# EAGLE schematic MPPT_power (EAGLE 7.4.0)
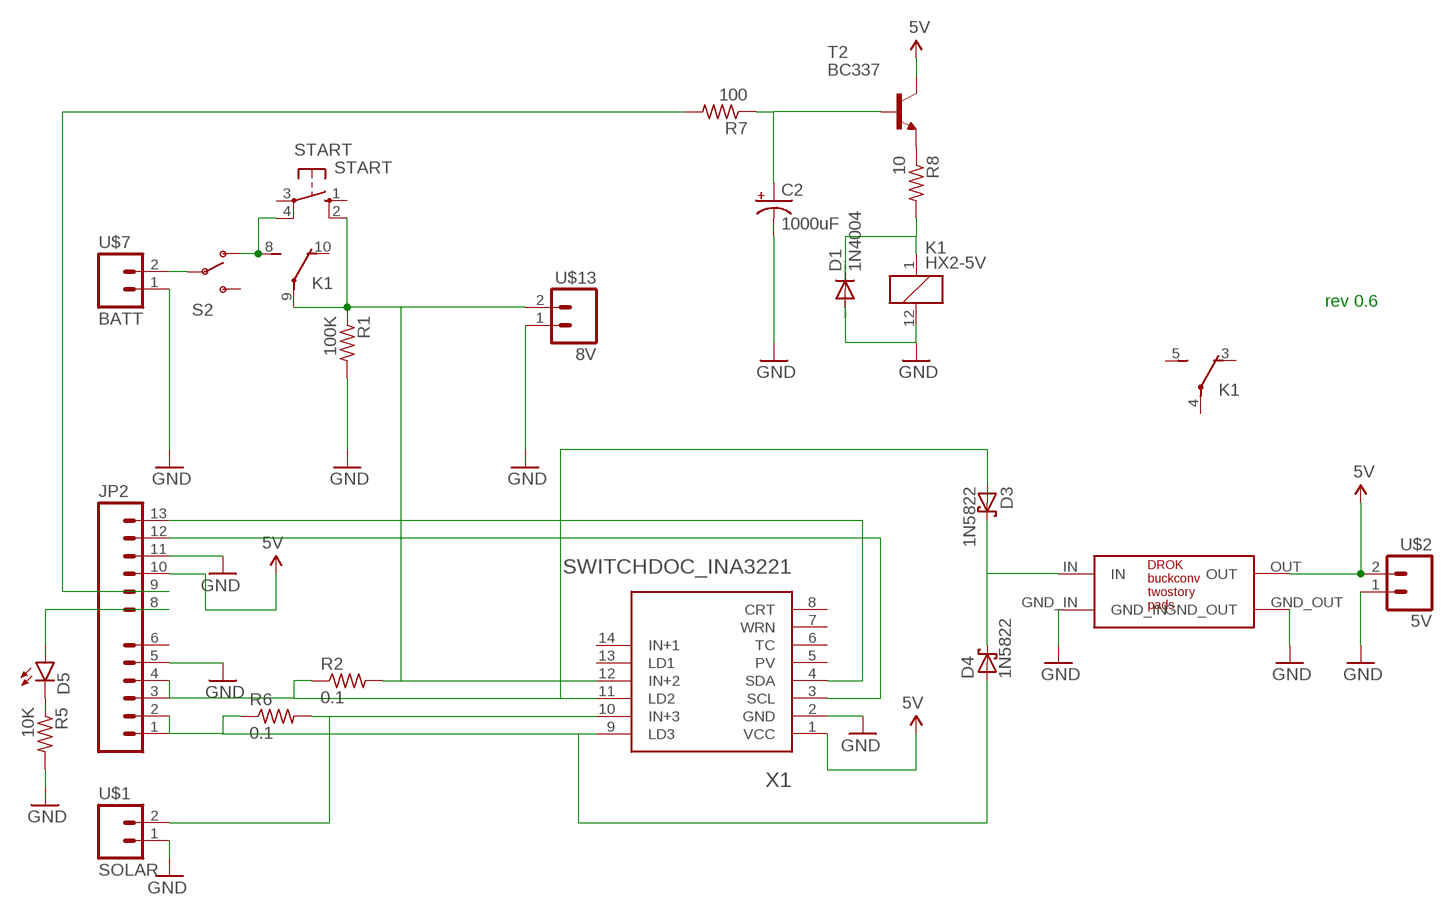
[diagram p0: schematic, sheet 1]

## Parts
C2  1000uF  1000UF-25V(PTH)  [CPOL-RADIAL-1000UF-25V]
D1  1N4004  [DO41-10]
D3  1N5822  [DO201T15]
D4  1N5822  [DO201T15]
D5  LED5MM  [LED5MM]
JP2  M06_PLUS_06MPPT  [M06_PLUS_06_MPPT]
K1  HX2-5V  [HX]
R1  100K  R-US_0204/7  [0204/7]
R2  0.1  R-US_  [0204/7_PHAT_PAD]
R5  10K  R-US_0204/7  [0204/7]
R6  0.1  R-US_  [0204/7_PHAT_PAD]
R7  100  R-US_0204/7  [0204/7]
R8  10  R-US_0204/7  [0204/7]
S2  SWITCH-SPDT  [SWITCH-SPDT_0.15_INCH]
START  START  10-XX  [B3F-10XX]
T2  BC337  [TO92]
U$1  SOLAR  SCREW_TERMINAL  [W237-132]
U$2  5V  SCREW_TERMINAL  [W237-132]
U$3  DROK_BUCKCONV_TWOSTORY_PADS  [DROK_BUCKCONV_TWOSTORY_PADS]
U$7  BATT  SCREW_TERMINAL  [W237-132]
U$13  8V  SCREW_TERMINAL  [W237-132]
X1  SWITCHDOC_INA3221  [SWITCHDOC_INA3221_NODRILL]

## Nets
5V: JP2.10 T2.3(C) U$2.2 U$3.OUT X1.1(VCC)
GND: C2.- D1.A JP2.5 JP2.11 K1.12 R1.2 R5.2 U$1.1 U$2.1 U$3.GND_IN U$3.GND_OUT U$7.1 U$13.1 X1.2(GND)
N$1: K1.9(3:P) R1.1 R2.2 START.2(S1) U$13.2 X1.12(IN+2)
N$2: D3.C D4.C U$3.IN
N$3: D5.K(C) R5.1
N$4: D5.A JP2.8
N$5: S2.2(P) U$7.2
N$6: R6.2 U$1.2 X1.10(IN+3)
N$7: R8.1 T2.1(E)
N$8: JP2.9 R7.2
N$9: K1.8(3:S) S2.1(O) START.4(P1)
N$10: C2.+ R7.1 T2.2(B)
N$11: JP2.13 X1.4(SDA)
N$12: JP2.12 X1.3(SCL)
N$13: D1.C K1.1 R8.2
N$15: D3.A JP2.3 JP2.4 R2.1 X1.11(LD2)
N$16: D4.A JP2.1 JP2.2 R6.1 X1.9(LD3)
Unconnected: JP2.6 K1.3(2:O) K1.4(2:P) K1.5(2:S) K1.10(3:O) S2.3(S) START.1(S) START.3(P) X1.5(PV) X1.6(TC) X1.7(WRN) X1.8(CRT) X1.13(LD1) X1.14(IN+1)

## Notes on the sheet
- rev 0.6

## Library data of the parts
C2 = SparkFun-Capacitors:1000UF-25V(PTH): CAP-08070; PROD_ID: CAP-09538; VALUE: CAP-09538
D1 = diode:1N4004: DIODE general purpose rectifier, 1 A
D3 D4 = tmb_diode:1N5822: DIODE
D5 = tmb_LED:LED: LEDs Standard schematic elements and footprints for 5mm, 3mm, 1206, and 0603 sized LEDs. 5mm - Spark Fun Electronics SKU : COM-00529 (and others)
JP2 = tmb_connectors:M06_PLUS_06: 13-pin single row .1" header
K1 = tmb_relay:HX2-*: Compact & Slim 2 Form C Non-polarized Relay NAiS Source: http://www.mew-europe.com/.. en_ds_61011_0000.pdf; OC_FARNELL: unknown; OC_NEWARK: unknown
R1 R2 R5-R8 = tmb_resistor:R-US_: RESISTOR, American symbol
S2 = tmb_switch:SWITCH-SPDT: SPDT Switch Simple slide switch, Spark Fun Electronics SKU : COM-00102 DPDT SMT slide switch, AYZ0202, SWCH-08179
START = switch-omron:10-XX: OMRON SWITCH
T2 = transistor-neu-to92:BC337: NPN TRANSISTOR
U$1 U$2 U$7 U$13 = tmb_connectors:SCREW_TERMINAL
U$3 = tmb_boards:DROK_BUCKCONV_TWOSTORY_PADS: Drok stepdown converter with current limit and analog controls. LED display for voltage and current. Two boards stacked.
X1 = tmb_boards:SWITCHDOC_INA3221: Switchdoc INA3221 breakout